# EAGLE design beacon (EAGLE 6.1)
BLE112 Breakout Board v2.0 Full breakout board for all BLE112 functions, with optional LEDs, programming header, USB access, etc.
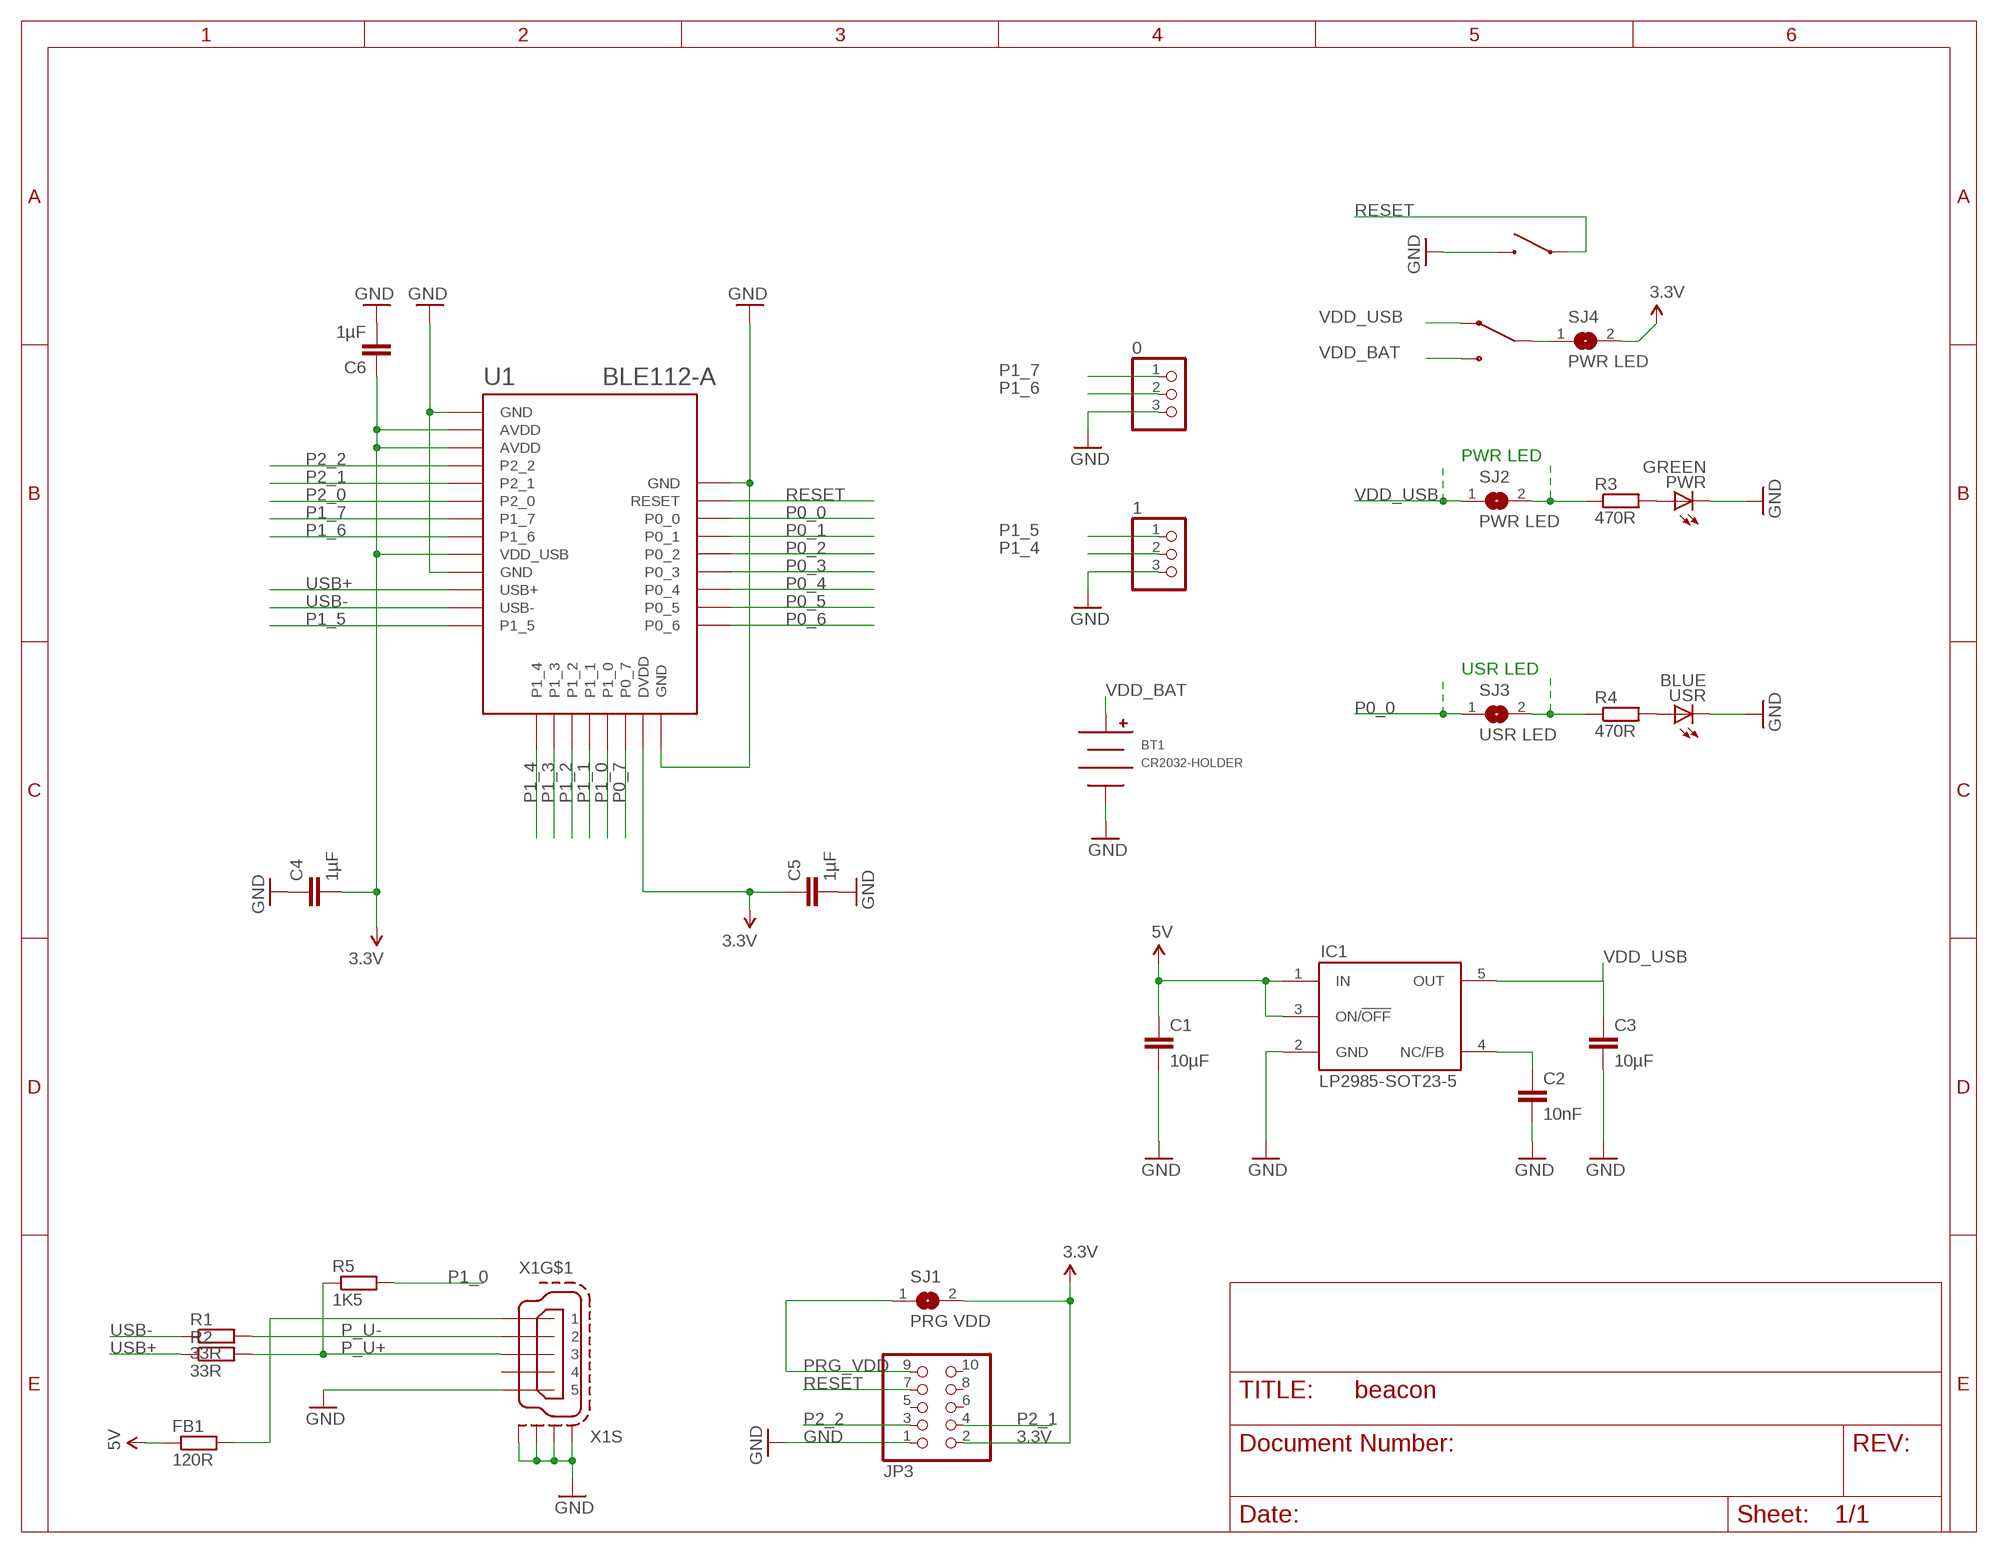
[diagram p0: schematic, sheet 1]

## Parts
0  HEADER-1X3ROUND  [1X03_ROUND]
1  HEADER-1X3ROUND  [1X03_ROUND]
BT1  CR2032-HOLDER  [CH28-2032LF]
C1  10µF  C-EUC0603  [C0603]
C2  10nF  C-EUC0603  [C0603]
C3  10µF  C-EUC0603  [C0603]
C4  1µF  C-EUC0603  [C0603]
C5  1µF  C-EUC0603  [C0603]
C6  1µF  C-EUC0603  [C0603]
FB1  120R  R-EU_R0603  [R0603]
IC1  LP2985-SOT23-5  [SOT23-5]
JP3  ARM-JTAG_1.27-SMD  [20021121-10010XXLF]
PWR  GREEN  LEDCHIPLED_0805  [CHIPLED_0805]
R1  33R  R-EU_R0603  [R0603]
R2  33R  R-EU_R0603  [R0603]
R3  470R  R-EU_R0603  [R0603]
R4  470R  R-EU_R0603  [R0603]
R5  1K5  R-EU_R0603  [R0603]
RST  TACT-SWITCH-40-40  [40-40]
SJ1  PRG VDD  SJ  [SJ]
SJ2  PWR LED  SJ  [SJ]
SJ3  USR LED  SJ  [SJ]
SJ4  PWR LED  SJ  [SJ]
U1  BLE112-A  BLE112-A-VISUAL  [BLE112-A]
U$1  1P2T  [1P2T-ON-ON]
USR  BLUE  LEDCHIPLED_0805  [CHIPLED_0805]
X1  MINI-USB-SCHIELD-32005-301  [32005-301]

## Nets
3.3V [power]: C4.2 C5.1 C6.1 JP3.2 SJ1.2 SJ4.2 U1.AVDD1(AVDD) U1.AVDD2(AVDD) U1.DVDD U1.VDD_USB
5V [power]: C1.1 FB1.1 IC1.1(IN) IC1.3(ON/!OFF)
GND [power]: 0.3 1.3 BT1.NEG C1.2 C2.2 C3.2 C4.1 C5.2 C6.2 IC1.2(GND) JP3.1 PWR.C RST.1 RST.2 U1.GND1(GND) U1.GND2(GND) U1.GND3(GND) U1.GND4(GND) USR.C X1.5 X1.M1(S:S1) X1.M2(S:S2) X1.M3(S:S3) X1.M4(S:S4)
N$1: PWR.A R3.2
N$2: R4.2 USR.A
N$3 [power]: R3.1 SJ2.2
N$4: SJ4.1 U$1.2
N$5: R4.1 SJ3.2
N$11: C2.1 IC1.4(NC/FB)
P0_0: SJ3.1 U1.P0_0
P0_1: U1.P0_1
P0_2: U1.P0_2
P0_3: U1.P0_3
P0_4: U1.P0_4
P0_5: U1.P0_5
P0_6: U1.P0_6
P0_7: U1.P0_7
P1_0: R5.2 U1.P1_0
P1_1: U1.P1_1
P1_2: U1.P1_2
P1_3: U1.P1_3
P1_4: 1.2 U1.P1_4
P1_5: 1.1 U1.P1_5
P1_6: 0.2 U1.P1_6
P1_7: 0.1 U1.P1_7
P2_0: U1.P2_0
P2_1: JP3.4 U1.P2_1
P2_2: JP3.3 U1.P2_2
P_U+: R2.2 R5.1 X1.3
P_U-: R1.2 X1.2
PRG_VDD [power]: JP3.9 SJ1.1
RESET: JP3.7 RST.3 RST.4 U1.RESET
USB+: R2.1 U1.USB+
USB-: R1.1 U1.USB-
VBUS [power]: FB1.2 X1.1
VDD_BAT: BT1.POS U$1.3
VDD_USB: C3.1 IC1.5(OUT) SJ2.1 U$1.1
Unconnected: JP3.5 JP3.6 JP3.8 JP3.10 X1.4

## Notes on the sheet
- PWR LED
- USR LED

## Library data of the parts
0 1 = microbuilder:HEADER-1X3: PIN HEADER
BT1 = battery-holder:CR2032-HOLDER
C1-C6 = rcl:C-EU: CAPACITOR, European symbol
FB1 R1-R5 = rcl:R-EU_: RESISTOR, European symbol
IC1 = vreg:LP2985
JP3 = nxp:ARM-JTAG: PIN HEADER
PWR USR = led:LED: LED OSRAM: - CHIPLED LG R971, LG N971, LY N971, LG Q971, LY Q971, LO R971, LY R971 LH N974, LH R974 LS Q976, LO Q976, LY Q976 LO Q996 - Hyper CHIPLED LW Q18S LB Q993, LB Q99A, LB R99A - SideLED LS A670, LO A670, LY A670, LG A670, LP A670 LB A673, LV A673, LT A673, LW A673 LH A674 LY A675 LS A676, LA A676, LO A676, LY A676, LW A676 LS A679, LY A679, LG A679 - Hyper Micro SIDELED® LS Y876, LA Y876, LO Y876, LY Y876 LT Y87S - SmartLED LW L88C, LW L88S LB L89C, LB L89S, LG L890 LS L89K, LO L89K, LY L89K LS L896, LA L896, LO L896, LY L896 - TOPLED LS T670, LO T670, LY T670, LG T670, LP T670 LSG T670, LSP T670, LSY T670, LOP T670, LYG T670 LG T671, LOG T671, LSG T671 LB T673, LV T673, LT T673, LW T673 LH T674 LS T676, LA T676, LO T676, LY T676, LB T676, LH T676, LSB T676, LW T676 LB T67C, LV T67C, LT T67C, LS T67K, LO T67K, LY T67K, LW E67C LS E67B, LA E67B, LO E67B, LY E67B, LB E67C, LV E67C, LT E67C LW T67C LS T679, LY T679, LG T679 LS T770, LO T770, LY T770, LG T770, LP T770 LB T773, LV T773, LT T773, LW T773 LH T774 LS E675, LA E675, LY E675, LS T675 LS T776, LA T776, LO T776, LY T776, LB T776 LHGB T686 LT T68C, LB T68C - Hyper Mini TOPLED® LB M676 - Mini TOPLED Santana® LG M470 LS M47K, LO M47K, LY M47K Source: http://www.osram.convergy.de LUXEON: - LUMILED® LXK2-PW12-R00, LXK2-PW12-S00, LXK2-PW14-U00, LXK2-PW14-V00 LXK2-PM12-R00, LXK2-PM12-S00, LXK2-PM14-U00 LXK2-PE12-Q00, LXK2-PE12-R00, LXK2-PE12-S00, LXK2-PE14-T00, LXK2-PE14-U00 LXK2-PB12-K00, LXK2-PB12-L00, LXK2-PB12-M00, LXK2-PB14-N00, LXK2-PB14-P00, LXK2-PB14-Q00 LXK2-PR12-L00, LXK2-PR12-M00, LXK2-PR14-Q00, LXK2-PR14-R00 LXK2-PD12-Q00, LXK2-PD12-R00, LXK2-PD12-S00 LXK2-PH12-R00, LXK2-PH12-S00 LXK2-PL12-P00, LXK2-PL12-Q00, LXK2-PL12-R00 Source: www.luxeon.com KINGBRIGHT: KA-3528ASYC Source: www.kingbright.com
RST = tactile-switch:TACT-SWITCH-40-40
SJ1-SJ4 = jumper:SJ: SMD solder JUMPER
U1 = sf-bluegiga:BLE112-A-VISUAL: Bluetooth Low Energy single-mode module - Bluetooth 4.0, chip antenna
U$1 = switch:1P2T
X1 = con-cypressindustries:MINI-USB-SCHIELD-: MINI USB-B Conector Source: www.cypressindustries.com; OC_FARNELL: unknown; OC_NEWARK: unknown

## Net classes
0 default: width 0.152 mm, drill 0.33 mm, clearance 0.152 mm
1 power: width 0.254 mm, drill 0.33 mm, clearance 0.152 mm

## Board
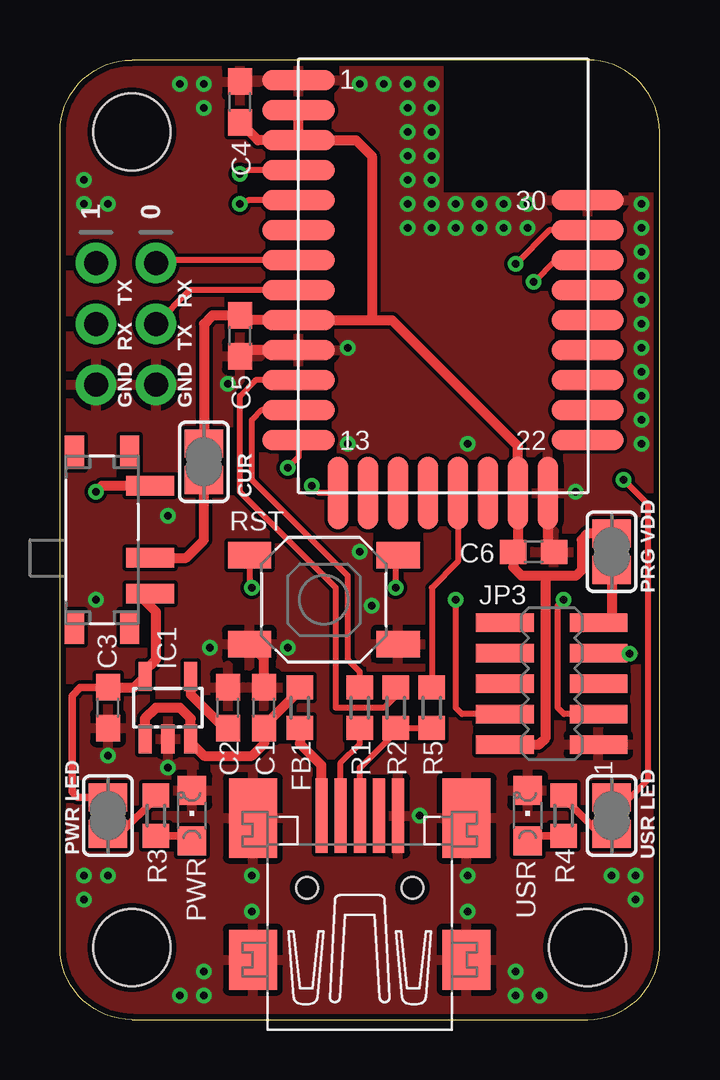
[diagram p1: board, top side]
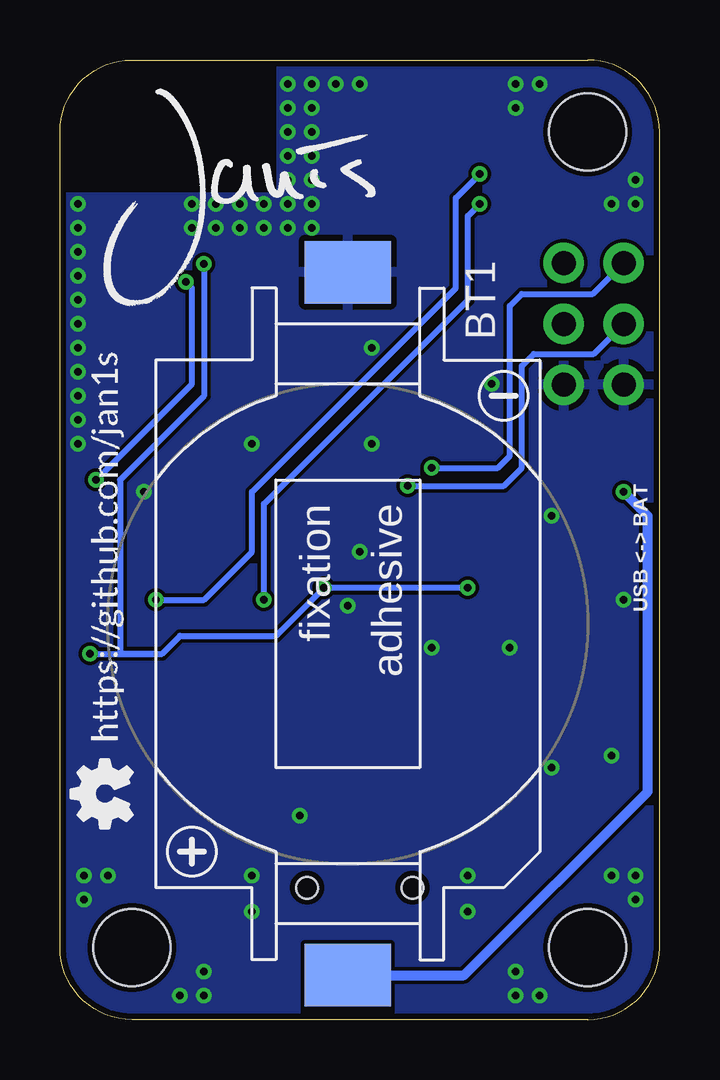
[diagram p2: board, bottom side, seen from below]

Size 25 x 40 mm. Coordinates in mm from the lower left corner, seen from the top.
Outline: 3,0 22,0 arc90 25,3 25,37 arc90 22,40 3,40 arc90 0,37 0,3 arc90 3,0
Copper layers (1*16): Top 0.035mm / dielectric 1.5mm / Bottom 0.035mm
Design rules: minimum track width 5mil, minimum drill 12mil, track to track 5mil, track to pad 5mil, pad to pad 5mil, via to via 5mil, smd to smd 0mil, copper to edge 10mil, drill to drill 10mil, minimum pad ring 10mil, minimum via ring 6mil, stop-mask expansion 2mil, vias tented up to drill 25mil, thermal gap 10mil
Holes 3.2 mm at 22,3 3,3 3,37
tRestrict: area 16,34.5 to 25,40
bRestrict: area 16,34.5 to 25,40

### Footprints (pad centres in the part's own frame; a part is rotated, then mirrored left to right if it is on the bottom)
1X03_ROUND = drill 1 pad 1.676: 1 -2.54,0; 2 0,0; 3 2.54,0
CH28-2032LF = smd 3.6 x 2.6: NEG 0,-14.65; POS 0,14.65
C0603 = smd 1.1 x 1: 1 -0.85,0; 2 0.85,0
R0603 = smd 1 x 1.1: 1 -0.85,0; 2 0.85,0
SOT23-5 = smd 0.55 x 1.2: 1 -0.95,-1.3; 2 0,-1.3; 3 0.95,-1.3; 4 0.95,1.3; 5 -0.95,1.3
20021121-10010XXLF = smd 0.76 x 2.4: 1 -2.54,-1.95; 2 -2.54,1.95; 3 -1.27,-1.95; 4 -1.27,1.95; 5 0,-1.95; 6 0,1.95; 7 1.27,-1.95; 8 1.27,1.95; 9 2.54,-1.95; 10 2.54,1.95
CHIPLED_0805 = smd 1.2 x 1.2: A 0,-1.05; C 0,1.05
40-40 = smd 1.8 x 1.1: 1 -3.1,1.85; 2 3.1,1.85; 3 -3.1,-1.85; 4 3.1,-1.85
SJ = smd 1.168 x 1.6: 1 -0.762,0; 2 0.762,0
BLE112-A = smd 3 x 0.85: AVDD1 -6.05,6.9; AVDD2 -6.05,5.65; GND1 -6.05,8.15; GND2 -6.05,-3.1; GND4 6,3.15; P0_0 6,0.65; P0_1 6,-0.6; P0_2 6,-1.85; P0_3 6,-3.1; P0_4 6,-4.35; P0_5 6,-5.6; P0_6 6,-6.85; P1_5 -6.05,-6.85; P1_6 -6.05,-0.6; P1_7 -6.05,0.65; P2_0 -6.05,1.9; P2_1 -6.05,3.15; P2_2 -6.05,4.4; RESET 6,1.9; USB+ -6.05,-4.35; USB- -6.05,-5.6; VDD_USB -6.05,-1.85 | smd 0.85 x 3: DVDD 3.1,-9.05; GND3 4.35,-9.05; P0_7 1.85,-9.05; P1_0 0.6,-9.05; P1_1 -0.65,-9.05; P1_2 -1.9,-9.05; P1_3 -3.15,-9.05; P1_4 -4.4,-9.05
1P2T-ON-ON = smd 2 x 0.8: 1 -2,2.25; 2 -2,0.75; 3 -2,-2.25 | smd 0.8 x 1.4: S1 1.15,3.65; S2 -1.15,3.65; S3 -1.15,-3.65; S4 1.15,-3.65
32005-301 = smd 3.1 x 0.5: 1 3,1.6; 2 3,0.8; 3 3,0; 4 3,-0.8; 5 3,-1.6 | smd 2.5 x 2: M1 -3,-4.45; M2 -3,4.45 | smd 3.3 x 2: M3 2.9,4.45; M4 2.9,-4.45 | hole 0.9: 0,2.2; 0,-2.2

### Placement (x,y rotation side)
0  4,29 270 top
1  1.5,29 270 top
BT1  13,16.5 180 bottom
C1  8.5,13 90 top
C2  7,13 90 top
C3  2,13 270 top
C4  7.5,38.25 270 top
C5  7.5,28.5 270 top
C6  19.75,19.5 0 top
FB1  10,13 270 top
IC1  4.5,13 0 top
JP3  20.5,14 90 top
PWR  5.5,8.5 0 top
R1  12.5,13 270 top
R2  14,13 270 top
R3  4,8.5 270 top
R4  21,8.5 270 top
R5  15.5,13 90 top
RST  11,17.5 180 top
SJ1  23,19.5 90 top
SJ2  2,8.5 270 top
SJ3  23,8.5 270 top
SJ4  6,23.25 90 top
U1  16,31 0 top
U$1  1.75,20 180 top
U$2  [JANIS_10MM]  23.5,29.5 0 bottom
U$3  [GITHUB/JAN1S]  22.5,11.5 90 bottom
U$4  [OSHW_FILLX100_NOTEXT]  22,8 90 bottom
USR  19.5,8.5 0 top
X1  12.5,5.5 90 top

### Tracks (layer width: path | path; a pad name or v marks a point on that pad's centre or on a via)
3.3V
  Top 0.406: 13,29.15 U1.VDD_USB 7.2,29.15 C5.1 6.35,29.35 6,29 SJ4.2 | 13,29.15 13.85,29.15 19.1,23.9 U1.DVDD 19.1,19.55 C6.1 18.9,18.85 19.25,18.5 20.25,18.5 | U1.AVDD2 12.35,36.65 13,36 13,29.15 | U1.AVDD2 U1.AVDD1 | JP3.2 19.96,11.46 20.25,11.75 20.25,18.5 | U1.AVDD2 8.25,36.65 C4.2 | SJ1.2 22.01,20.26 21.75,20 21.75,18.75 21.5,18.5 20.25,18.5
5V
  Top 0.406: IC1.1 3.55,12.55 4,13 5,13 5.45,12.55 IC1.3 5.45,11.55 6,11 8,11 8.5,11.5 C1.1 8.5,12.25 10,13.75 FB1.1
GND  (via drill 0.33)
  Top 0.406: U1.GND2 7.75,27.9 C5.2 | U1.GND3 20.35,19.65 20.5,19.5 C6.2 | C1.2 8.5,15.05 RST.2
  other vias: 16.5,34 17.5,34 18.5,34 19.5,34 15.5,34 15.5,35 15.5,36 15.5,37 15.5,38 15.5,39 14.5,39 13.5,39 12.5,39 19.5,33 24.25,34 24.25,33 14.5,38 14.5,37 14.5,36 14.5,35 14.5,34 14.5,33 15.5,33 16.5,33 17.5,33 18.5,33 5,39 6,39 1,35 1,34 1,5 1,6 5,1 6,1 20,1 19,1 24,5 24,6 7,26.5 12,28 21.5,22 24.25,32 24.25,31 24.25,30 24.25,29 24.25,28 24.25,27 24.25,26 24.25,25 24.25,24 12,24 17,24 2,34 1.5,17.5 4.5,21 4.5,10.5 2,11 6.25,15.5 13,17.25 8,4.5 8,6 17,6 17,4.5 15,8.5 9.5,15.5 12.5,19.5 6,38 2,6 6,2 19,2 23,6
  pour Top: 0,0 25,0 25,34.5 16,34.5 16,40 0,40
  pour Bottom: 0,0 25,0 25,34.5 16,34.5 16,40 0,40
N$1
  Top 0.305: R3.2 5.3,7.65 PWR.A
N$2
  Top 0.305: R4.2 19.7,7.65 USR.A
N$3
  Top 0.305: SJ2.2 2.49,7.74 4,9.25 R3.1
N$4
  Top 0.406: U$1.2 5.25,19.25 6,20 SJ4.1
N$5
  Top 0.305: SJ3.2 22.51,7.74 21,9.25 R4.1
N$11
  Top 0.406: IC1.4 5.45,13.55 6.85,12.15 C2.1
P0_0  (via drill 0.33)
  Top 0.254: SJ3.1 23.5,9 24.5,10 24.5,21.5 v23.5,22.5 | v19.75,30.75 20.65,31.65 U1.P0_0
  Bottom 0.254: v23.5,22.5 19.5,26.5 19.5,30.5 v19.75,30.75
P1_0
  Top 0.254: U1.P1_0 16.6,19.1 15.5,18 R5.2
P1_4  (via drill 0.33)
  Top 0.254: U1.P1_4 10.8,21.95 v10.5,22.25
  Bottom 0.254: v10.5,22.25 6.5,22.25 5.75,23 5.75,27.25 5.25,27.75 2.75,27.75 1.2
P1_5  (via drill 0.33)
  Top 0.254: U1.P1_5 9.95,23.45 v9.5,23
  Bottom 0.254: v9.5,23 6.75,23 6.25,23.5 6.25,29.75 5.75,30.25 2.79,30.25 1.1
P1_6
  Top 0.254: U1.P1_6 5.4,30.4 0.2
P1_7
  Top 0.254: U1.P1_7 4.39,31.65 0.1
P2_1  (via drill 0.33)
  Top 0.254: JP3.4 16.77,12.73 16.5,13 v16.5,17.5 | U1.P2_1 7.85,34.15 v7.5,34
  Bottom 0.254: v16.5,17.5 16.5,21.5 8,30 8,33.5 v7.5,34
P2_2  (via drill 0.33)
  Top 0.254: JP3.3 21.02,12.73 20.75,13 20.75,17.25 v21,17.5 | U1.P2_2 7.85,35.4 v7.5,35.25
  Bottom 0.254: v21,17.5 19,17.5 17,19.5 17,22 8.5,30.5 8.5,34.25 v7.5,35.25
P_U+
  Top 0.254: X1.3 12.5,10.5 14,12 R2.2 R5.1
P_U-
  Top 0.254: X1.2 11.7,10.7 12.5,11.5 R1.2
PRG_VDD
  Top 0.406: SJ1.1 23,16.5 22.49,16.5 JP3.9
RESET  (via drill 0.33)
  Top 0.254: JP3.7 23.98,15.27 v23.75,15.25 | 23.35,32.9 U1.RESET 20.4,32.9 v19,31.5 | v14,18 14,19.25 RST.3 | RST.4 7.9,18.1 v8,18
  Bottom 0.254: v23.75,15.25 21,15.25 | v19,31.5 19,26 22.5,22.5 22.5,15.32 JP3.7 21.02,15.27 21,15.25 | 21,15.25 20.75,15.25 20,16 16,16 v14,18 v8,18
USB+
  Top 0.254: R2.1 14,13.5 13.5,13 11.5,13 11.5,18 7.5,22 7.5,26 8.15,26.65 U1.USB+
USB-
  Top 0.254: R1.1 12.5,14.5 12,15 12,18.5 8,22.5 8,25 8.4,25.4 U1.USB-
VBUS
  Top 0.406: X1.1 10.9,10.6 10,11.5 FB1.2
VDD_BAT  (via drill 0.33)
  Top 0.406: U$1.3 1.75,22.25 v1.5,22
  Bottom 0.406: BT1.POS 8.15,1.85 0.5,9.5 0.5,21 v1.5,22
VDD_USB
  Top 0.305: SJ2.1 0.74,9.26 0.5,9.5 0.5,13.5 0.85,13.85 C3.1
  Top 0.406: C3.1 3.1,13.85 IC1.5 3.55,14.55 4,15 4,17 3.55,17.45 3.55,17.7 U$1.1

### Text on the board
tPlace: GND RX TX | GND TX RX | CUR | PRG VDD | PWR LED | USR LED
bPlace: USB <-> BAT